# EAGLE design LightRetaggioSchema5pz (EAGLE 9.2.2)
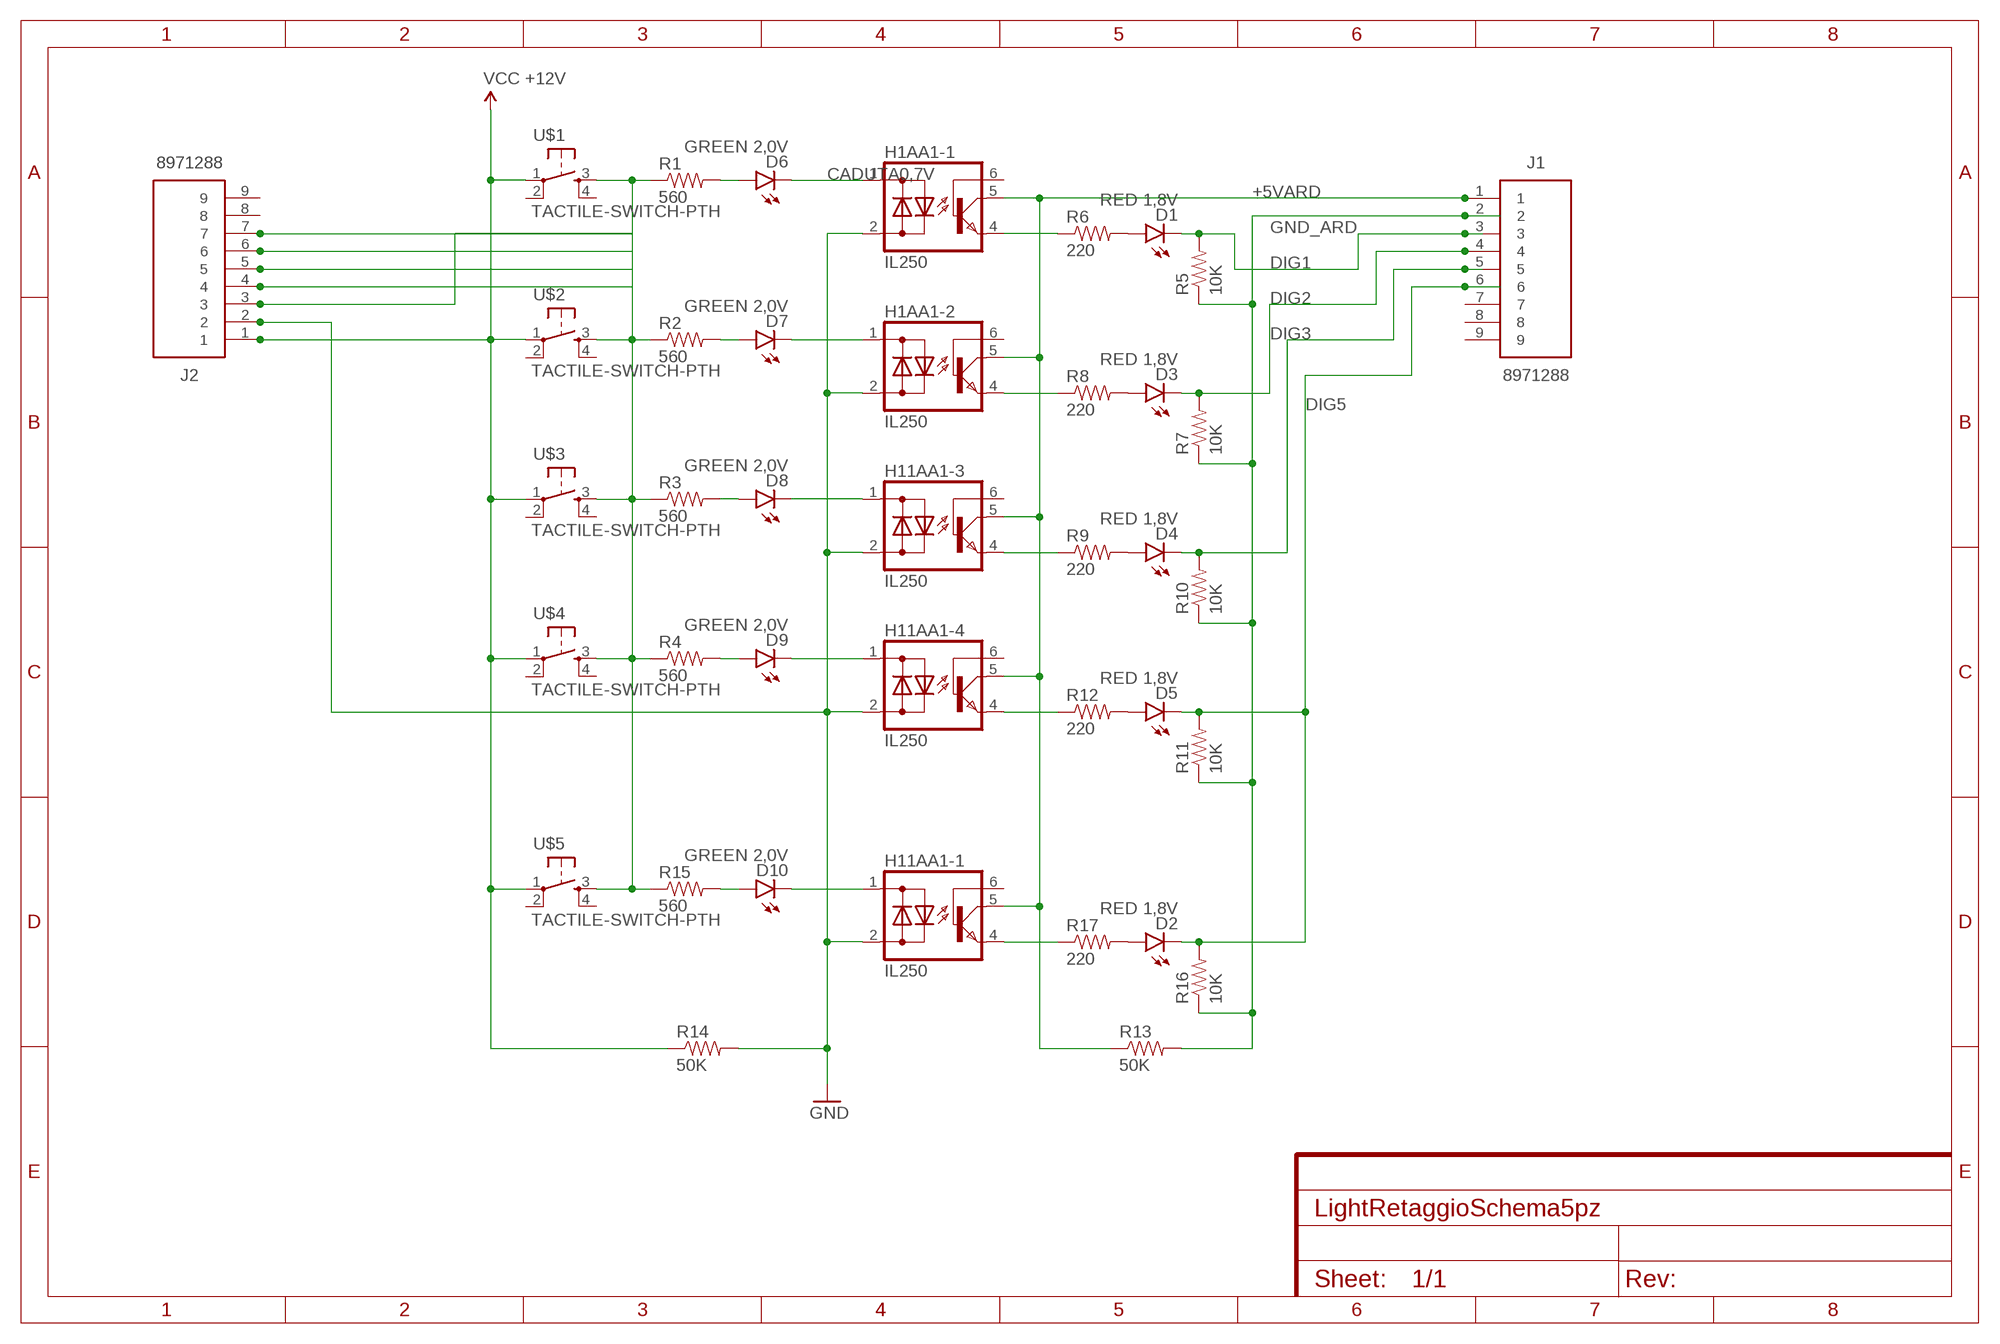
[diagram p0: schematic, sheet 1]

## Parts
D1  RED 1,8V  LED-RED1206  [LED-1206]
D2  RED 1,8V  LED-RED1206  [LED-1206]
D3  RED 1,8V  LED-RED1206  [LED-1206]
D4  RED 1,8V  LED-RED1206  [LED-1206]
D5  RED 1,8V  LED-RED1206  [LED-1206]
D6  GREEN 2,0V  LED-RED1206  [LED-1206]
D7  GREEN 2,0V  LED-RED1206  [LED-1206]
D8  GREEN 2,0V  LED-RED1206  [LED-1206]
D9  GREEN 2,0V  LED-RED1206  [LED-1206]
D10  GREEN 2,0V  LED-RED1206  [LED-1206]
H1AA1-1  IL250  [DIL06]
H1AA1-2  IL250  [DIL06]
H11AA1-1  IL250  [DIL06]
H11AA1-3  IL250  [DIL06]
H11AA1-4  IL250  [DIL06]
J1  8971288  [SHDR9W100P0X508_1X9_4690X1210X]
J2  8971288  [SHDR9W100P0X508_1X9_4690X1210X]
R1  560  RESISTORPTH-1/4W  [AXIAL-0.4]
R2  560  RESISTORPTH-1/4W  [AXIAL-0.4]
R3  560  RESISTORPTH-1/4W  [AXIAL-0.4]
R4  560  RESISTORPTH-1/4W  [AXIAL-0.4]
R5  10K  RESISTORPTH-1/4W  [AXIAL-0.4]
R6  220  RESISTORPTH-1/4W  [AXIAL-0.4]
R7  10K  RESISTORPTH-1/4W  [AXIAL-0.4]
R8  220  RESISTORPTH-1/4W  [AXIAL-0.4]
R9  220  RESISTORPTH-1/4W  [AXIAL-0.4]
R10  10K  RESISTORPTH-1/4W  [AXIAL-0.4]
R11  10K  RESISTORPTH-1/4W  [AXIAL-0.4]
R12  220  RESISTORPTH-1/4W  [AXIAL-0.4]
R13  50K  RESISTORPTH-1/4W  [AXIAL-0.4]
R14  50K  RESISTORPTH-1/4W  [AXIAL-0.4]
R15  560  RESISTORPTH-1/4W  [AXIAL-0.4]
R16  10K  RESISTORPTH-1/4W  [AXIAL-0.4]
R17  220  RESISTORPTH-1/4W  [AXIAL-0.4]
U$1  TACTILE-SWITCH-PTH  [TAC-SWITCH-PTH]
U$2  TACTILE-SWITCH-PTH  [TAC-SWITCH-PTH]
U$3  TACTILE-SWITCH-PTH  [TAC-SWITCH-PTH]
U$4  TACTILE-SWITCH-PTH  [TAC-SWITCH-PTH]
U$5  TACTILE-SWITCH-PTH  [TAC-SWITCH-PTH]

## Nets
+5VARD: H1AA1-1.5(C) H1AA1-2.5(C) H11AA1-1.5(C) H11AA1-3.5(C) H11AA1-4.5(C) J1.1 R13.P$1
CADUTA0,7V: D6.C H1AA1-1.1(AC1)
DIG1: D1.C J1.3 R5.P$2
DIG2: D3.C J1.4 R7.P$2
DIG3: D4.C J1.5 R10.P$2
DIG5: D2.C D5.C J1.6 R11.P$2 R16.P$2
GND: H1AA1-1.2(AC2) H1AA1-2.2(AC2) H11AA1-1.2(AC2) H11AA1-3.2(AC2) H11AA1-4.2(AC2) J2.2 R14.P$2
GND_ARD: J1.2 R5.P$1 R7.P$1 R10.P$1 R11.P$1 R13.P$2 R16.P$1
N$1: J2.4 J2.5 R3.P$1 U$3.3
N$2: R2.P$1 U$2.3
N$3: J2.6 R4.P$1 U$4.3
N$4: D9.C H11AA1-4.1(AC1)
N$5: D8.C H11AA1-3.1(AC1)
N$6: D7.C H1AA1-2.1(AC1)
N$8: J2.3 R1.P$1 U$1.3
N$9: H1AA1-1.4(E) R6.P$1
N$10: D1.A R6.P$2
N$11: D4.A R9.P$2
N$12: D3.A R8.P$2
N$13: H1AA1-2.4(E) R8.P$1
N$14: D5.A R12.P$2
N$15: H11AA1-4.4(E) R12.P$1
N$16: D8.A R3.P$2
N$17: H11AA1-3.4(E) R9.P$1
N$18: D9.A R4.P$2
N$19: D7.A R2.P$2
N$20: D6.A R1.P$2
N$21: J2.7 R15.P$1 U$5.3
N$22: D10.C H11AA1-1.1(AC1)
N$23: D2.A R17.P$2
N$24: H11AA1-1.4(E) R17.P$1
N$25: D10.A R15.P$2
VCC: J2.1 R14.P$1 U$1.1 U$2.1 U$3.1 U$4.1 U$5.1 ; supply symbol labelled VCC +12V
Unconnected: H1AA1-1.6(B) H1AA1-2.6(B) H11AA1-1.6(B) H11AA1-3.6(B) H11AA1-4.6(B) J1.7 J1.8 J1.9 J2.8 J2.9 U$1.2 U$1.4 U$2.2 U$2.4 U$3.2 U$3.4 U$4.2 U$4.4 U$5.2 U$5.4

## Library data of the parts
D1-D10 = SparkFun-LED:LED-RED: Assorted Red LEDs LilyPad 1206- DIO-09912 1206- DIO-00809 0603- DIO-00819 "SMART" means more efficient and expensive; PROD_ID: DIO-09912; VALUE: RED
H1AA1-1 H1AA1-2 H11AA1-1 H11AA1-3 H11AA1-4 = optocoupler:IL250: SIEMENS OPTO COUPLER; MF: VISHAY/TELEFUNKEN; MPN: IL250; OC_FARNELL: 1469559; OC_NEWARK: 58K1705
J1 J2 = 8971288:8971288: 5.08 PCB terminal block, R/A header, 9P <http://uk.rs-online.com/largeimages/R8971288-01.jpg> Source: Datasheet <http://docs-europe.electrocomponents.com/webdocs/143d/0900766b8143d395.pdf>; DESCRIPTION: 5.08 PCB terminal block, R/A header, 9P; HEIGHT: 8.3mm; MANUFACTURER_NAME: RS Components; MANUFACTURER_PART_NUMBER: 8971288; RS_PART_NUMBER: 8971288; SUPPLIER_NAME: RS
R1-R17 = SparkFun-Passives:RESISTOR: Resistor Basic schematic elements and footprints for 0603, 1206, and PTH resistors.
U$1-U$5 = GeekAmmo:TACTILE-SWITCH: Tactile Switch 4 Pins, SPST NO

## Board
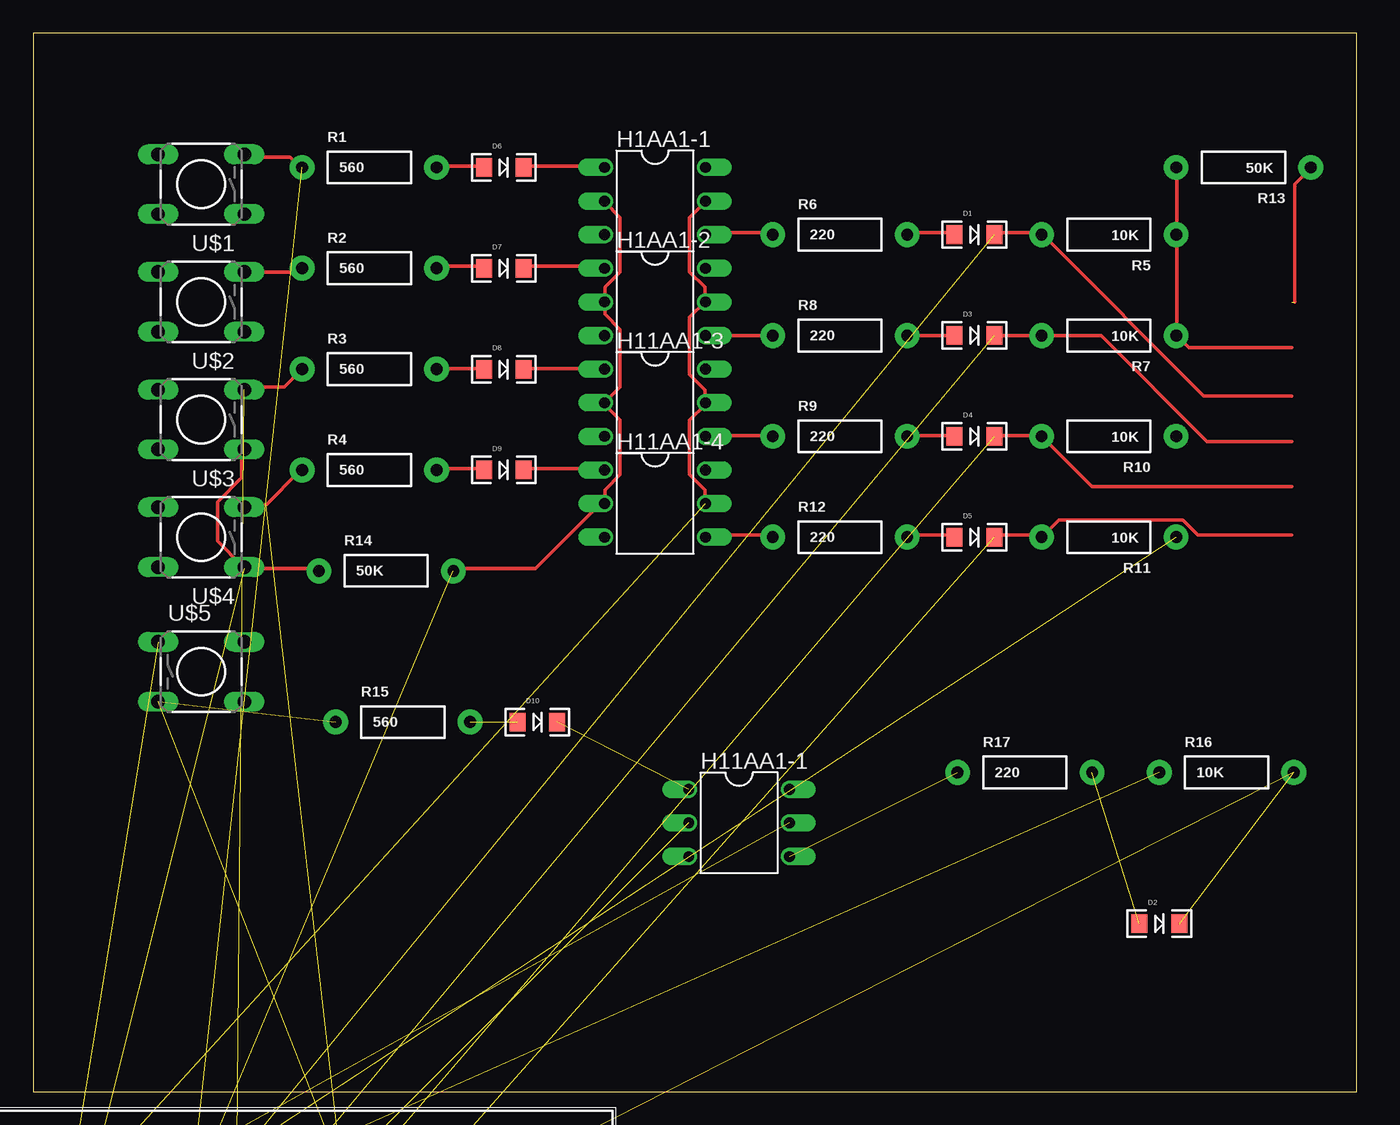
[diagram p1: board, top side]
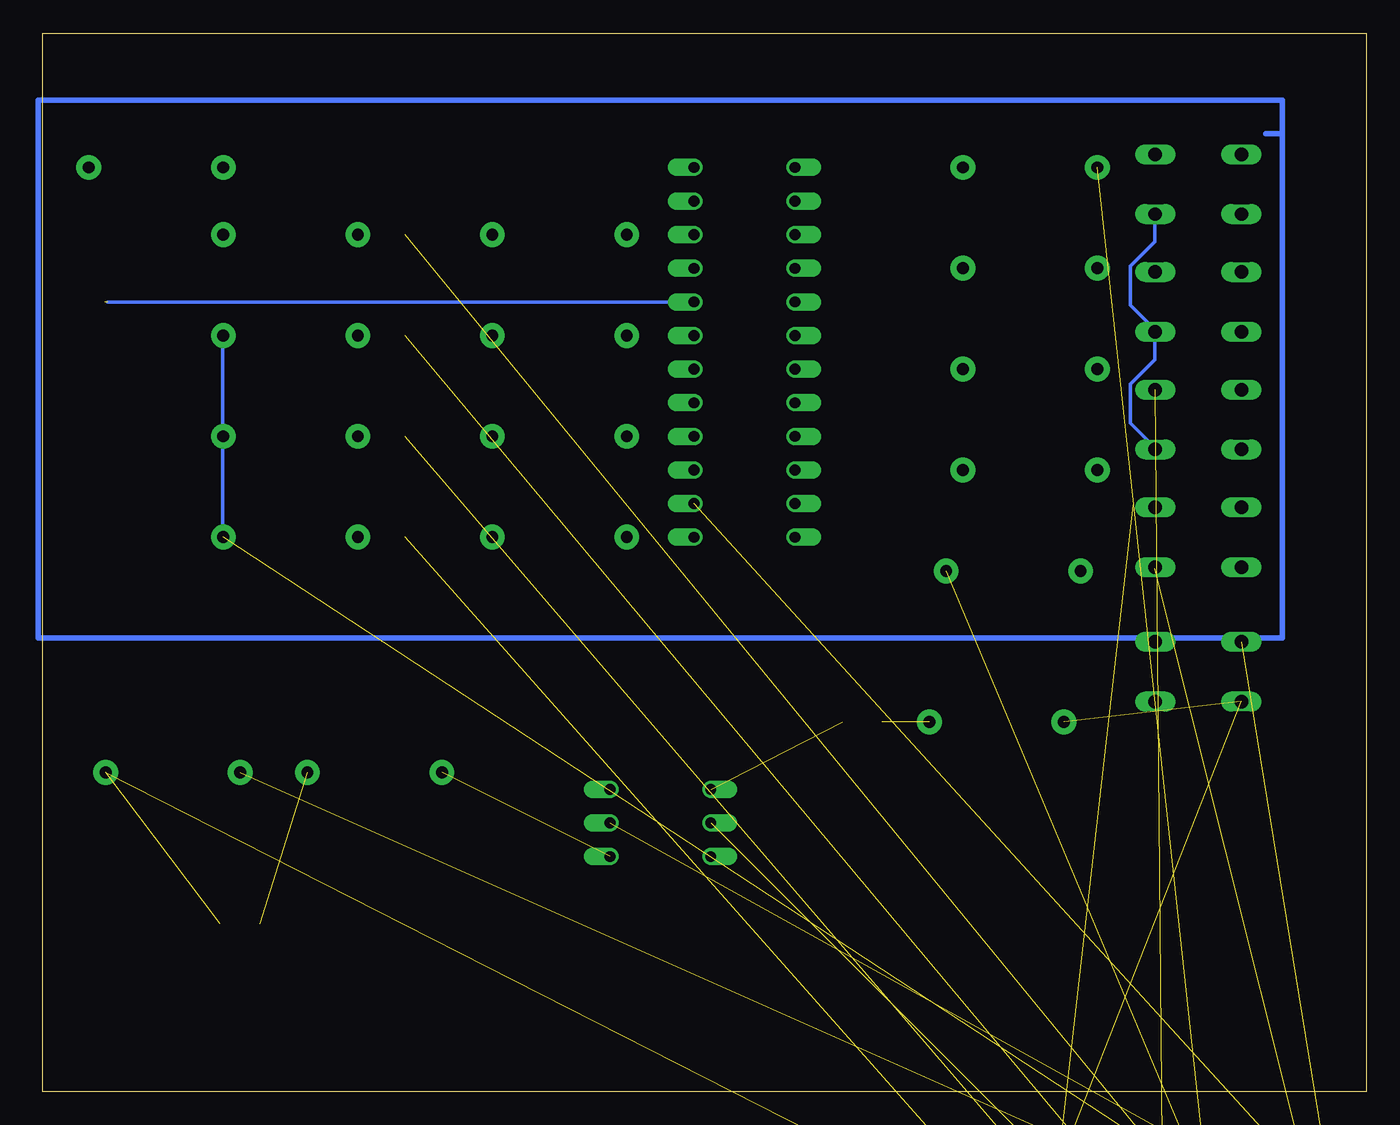
[diagram p2: board, bottom side, seen from below]

Size 100 x 80 mm. Coordinates in mm from the lower left corner, seen from the top.
Outline: 0,0 100,0 100,80 0,80 0,0
Copper layers (1*16): Top 0.035mm / dielectric 1.5mm / Bottom 0.035mm
Design rules "default": minimum track width 10mil, minimum drill 24mil, track to track 8mil, track to pad 8mil, pad to pad 8mil, via to via 8mil, smd to smd 8mil, copper to edge 40mil, drill to drill 8mil, minimum pad ring 10mil, minimum via ring 8mil, stop-mask expansion 4mil, vias tented up to drill 0mil, thermal gap 10mil

### Footprints (pad centres in the part's own frame; a part is rotated, then mirrored left to right if it is on the bottom)
LED-1206 = smd 1.2 x 1.4: A -1.5,0; C 1.5,0
DIL06 = drill 0.813 offset: 1 -2.54,-3.81; 2 0,-3.81; 3 2.54,-3.81; 4 2.54,3.81; 5 0,3.81; 6 -2.54,3.81
SHDR9W100P0X508_1X9_4690X1210X = drill 1.6 pad 2.4 square: 1 0,0 | drill 1.6 pad 2.4: 2 5.08,0; 3 10.16,0; 4 15.24,0; 5 20.32,0; 6 25.4,0; 7 30.48,0; 8 35.56,0; 9 40.64,0
AXIAL-0.4 = drill 0.9 pad 1.88: P$1 -5.08,0; P$2 5.08,0
TAC-SWITCH-PTH = drill 1.016 pad 1.524 long: 1 -3.251,2.261; 2 3.251,2.261; 3 -3.251,-2.261; 4 3.251,-2.261

### Placement (x,y rotation side)
D1  71.12,64.77 0 top
D2  85.09,12.7 0 top
D3  71.12,57.15 0 top
D4  71.12,49.53 0 top
D5  71.12,41.91 0 top
D6  35.56,69.85 0 top
D7  35.56,62.23 0 top
D8  35.56,54.61 0 top
D9  35.56,46.99 0 top
D10  38.1,27.94 0 top
H1AA1-1  46.99,67.31 270 top
H1AA1-2  46.99,59.69 270 top
H11AA1-1  53.34,20.32 270 top
H11AA1-3  46.99,52.07 270 top
H11AA1-4  46.99,44.45 270 top
J1  0,-11.43 0 top  (outside the outline)
J2  0,-24.13 0 top  (outside the outline)
R1  25.4,69.85 0 top
R2  25.4,62.23 0 top
R3  25.4,54.61 0 top
R4  25.4,46.99 0 top
R5  81.28,64.77 180 top
R6  60.96,64.77 0 top
R7  81.28,57.15 180 top
R8  60.96,57.15 0 top
R9  60.96,49.53 0 top
R10  81.28,49.53 180 top
R11  81.28,41.91 180 top
R12  60.96,41.91 0 top
R13  91.44,69.85 180 top
R14  26.67,39.37 0 top
R15  27.94,27.94 0 top
R16  90.17,24.13 0 top
R17  74.93,24.13 0 top
U$1  12.7,68.58 180 top
U$2  12.7,59.69 180 top
U$3  12.7,50.8 180 top
U$4  12.7,41.91 180 top
U$5  12.7,31.75 0 top

### Tracks (layer width: path | path; a pad name or v marks a point on that pad's centre or on a via)
+5VARD  (3 unrouted)
  Top 0.254: 95.33,59.66 95.33,68.58 96.47,69.72 R13.P$1 | H11AA1-4.5 50.75,44.58 50.75,45.49 49.61,46.63 49.61,50.75 50.75,51.89 H11AA1-3.5 50.75,52.12 50.75,53.03 49.61,54.18 49.61,58.52 50.75,59.66 H1AA1-2.5 50.75,59.89 50.75,60.81 49.61,61.95 49.61,66.06 50.75,67.21 H1AA1-1.5
  Bottom 0.254: 95.1,59.66 50.98,59.66 H1AA1-2.5
CADUTA0,7V
  Top 0.254: D6.C 37.26,69.95 42.98,69.95 H1AA1-1.1
DIG1  (1 unrouted)
  Top 0.254: D1.C 72.69,64.92 76.12,64.92 R5.P$2 76.35,64.69 88.47,52.58 95.1,52.58
DIG2  (1 unrouted)
  Top 0.254: D3.C R7.P$2 80.7,57.15 88.7,49.15 95.1,49.15
DIG3  (1 unrouted)
  Top 0.254: D4.C 72.69,49.61 76.12,49.61 R10.P$2 80.01,45.72 95.1,45.72
DIG5  (3 unrouted)
  Top 0.254: D5.C 72.69,42.06 76.12,42.06 R11.P$2 77.5,43.2 86.87,43.2 88.01,42.06 95.1,42.06
GND  (2 unrouted)
  Top 0.254: H1AA1-1.2 43.2,67.21 44.35,66.06 44.35,61.95 43.2,60.81 43.2,59.89 H1AA1-2.2 43.2,59.66 43.2,58.75 44.35,57.61 44.35,53.26 43.2,52.12 H11AA1-3.2 43.2,51.89 44.35,50.75 44.35,46.63 43.2,45.49 43.2,44.58 H11AA1-4.2 42.98,44.58 37.95,39.55 31.77,39.55 R14.P$2
GND_ARD  (2 unrouted)
  Top 0.254: R13.P$2 86.41,69.72 86.41,64.92 R5.P$1 86.41,64.69 86.41,57.15 | 95.1,56.24 87.33,56.24 86.41,57.15 | 86.41,57.15 R7.P$1
  Bottom 0.254: R11.P$1 86.41,42.06 86.41,49.38 R10.P$1 86.41,49.61 86.41,57.15 R7.P$1
N$1  (2 unrouted)
  Top 0.254: R3.P$1 18.97,53.26 16,53.26 U$3.3
N$2
  Top 0.254: U$2.3 19.89,61.95 20.12,62.18 R2.P$1
N$3  (1 unrouted)
  Top 0.254: U$4.3 16,44.35 17.6,44.35 20.12,46.86 R4.P$1
N$4
  Top 0.254: D9.C 37.26,47.09 42.98,47.09 H11AA1-4.1
N$5
  Top 0.254: D8.C 37.26,54.63 42.98,54.63 H11AA1-3.1
N$6
  Top 0.254: D7.C 37.26,62.41 42.98,62.41 H1AA1-2.1
N$7
  Bottom 0.406: 7.62,72.39 6.35,72.39 | 6.35,72.39 6.35,34.29 100.33,34.29 100.33,74.93 6.35,74.93 6.35,72.39
N$8  (1 unrouted)
  Top 0.254: U$1.3 16,70.64 19.43,70.64 20.12,69.95 R1.P$1
N$9
  Top 0.254: H1AA1-1.4 50.98,64.92 55.78,64.92 R6.P$1
N$10
  Top 0.254: D1.A 69.49,64.92 66.06,64.92 R6.P$2
N$11
  Top 0.254: D4.A 69.49,49.61 66.06,49.61 R9.P$2
N$12
  Top 0.254: R8.P$2 D3.A
N$13
  Top 0.254: R8.P$1 H1AA1-2.4
N$14
  Top 0.254: D5.A 69.49,42.06 66.06,42.06 R12.P$2
N$15
  Top 0.254: H11AA1-4.4 50.98,42.06 55.78,42.06 R12.P$1
N$16
  Top 0.254: D8.A 33.83,54.63 30.63,54.63 R3.P$2
N$17
  Top 0.254: H11AA1-3.4 50.98,49.61 55.78,49.61 R9.P$1
N$18
  Top 0.254: D9.A 33.83,47.09 30.63,47.09 R4.P$2
N$19
  Top 0.254: D7.A 33.83,62.41 30.63,62.41 R2.P$2
N$20
  Top 0.254: D6.A 33.83,69.95 30.63,69.95 R1.P$2
N$21  (2 unrouted)
N$22  (1 unrouted)
N$23  (1 unrouted)
N$24  (1 unrouted)
N$25  (1 unrouted)
VCC  (2 unrouted)
  Top 0.254: R14.P$1 21.49,39.55 16,39.55 U$4.1 15.77,39.78 13.95,41.6 13.95,44.58 15.77,46.41 15.77,48.46 U$3.1
  Bottom 0.254: U$3.1 16,48.69 17.83,50.52 17.83,53.49 16,55.32 16,57.38 U$2.1 16,57.61 17.83,59.44 17.83,62.41 16,64.24 16,66.29 U$1.1